# EAGLE design vending-machine-v2-raspberrypi-expansion-r1 (EAGLE 5.11)
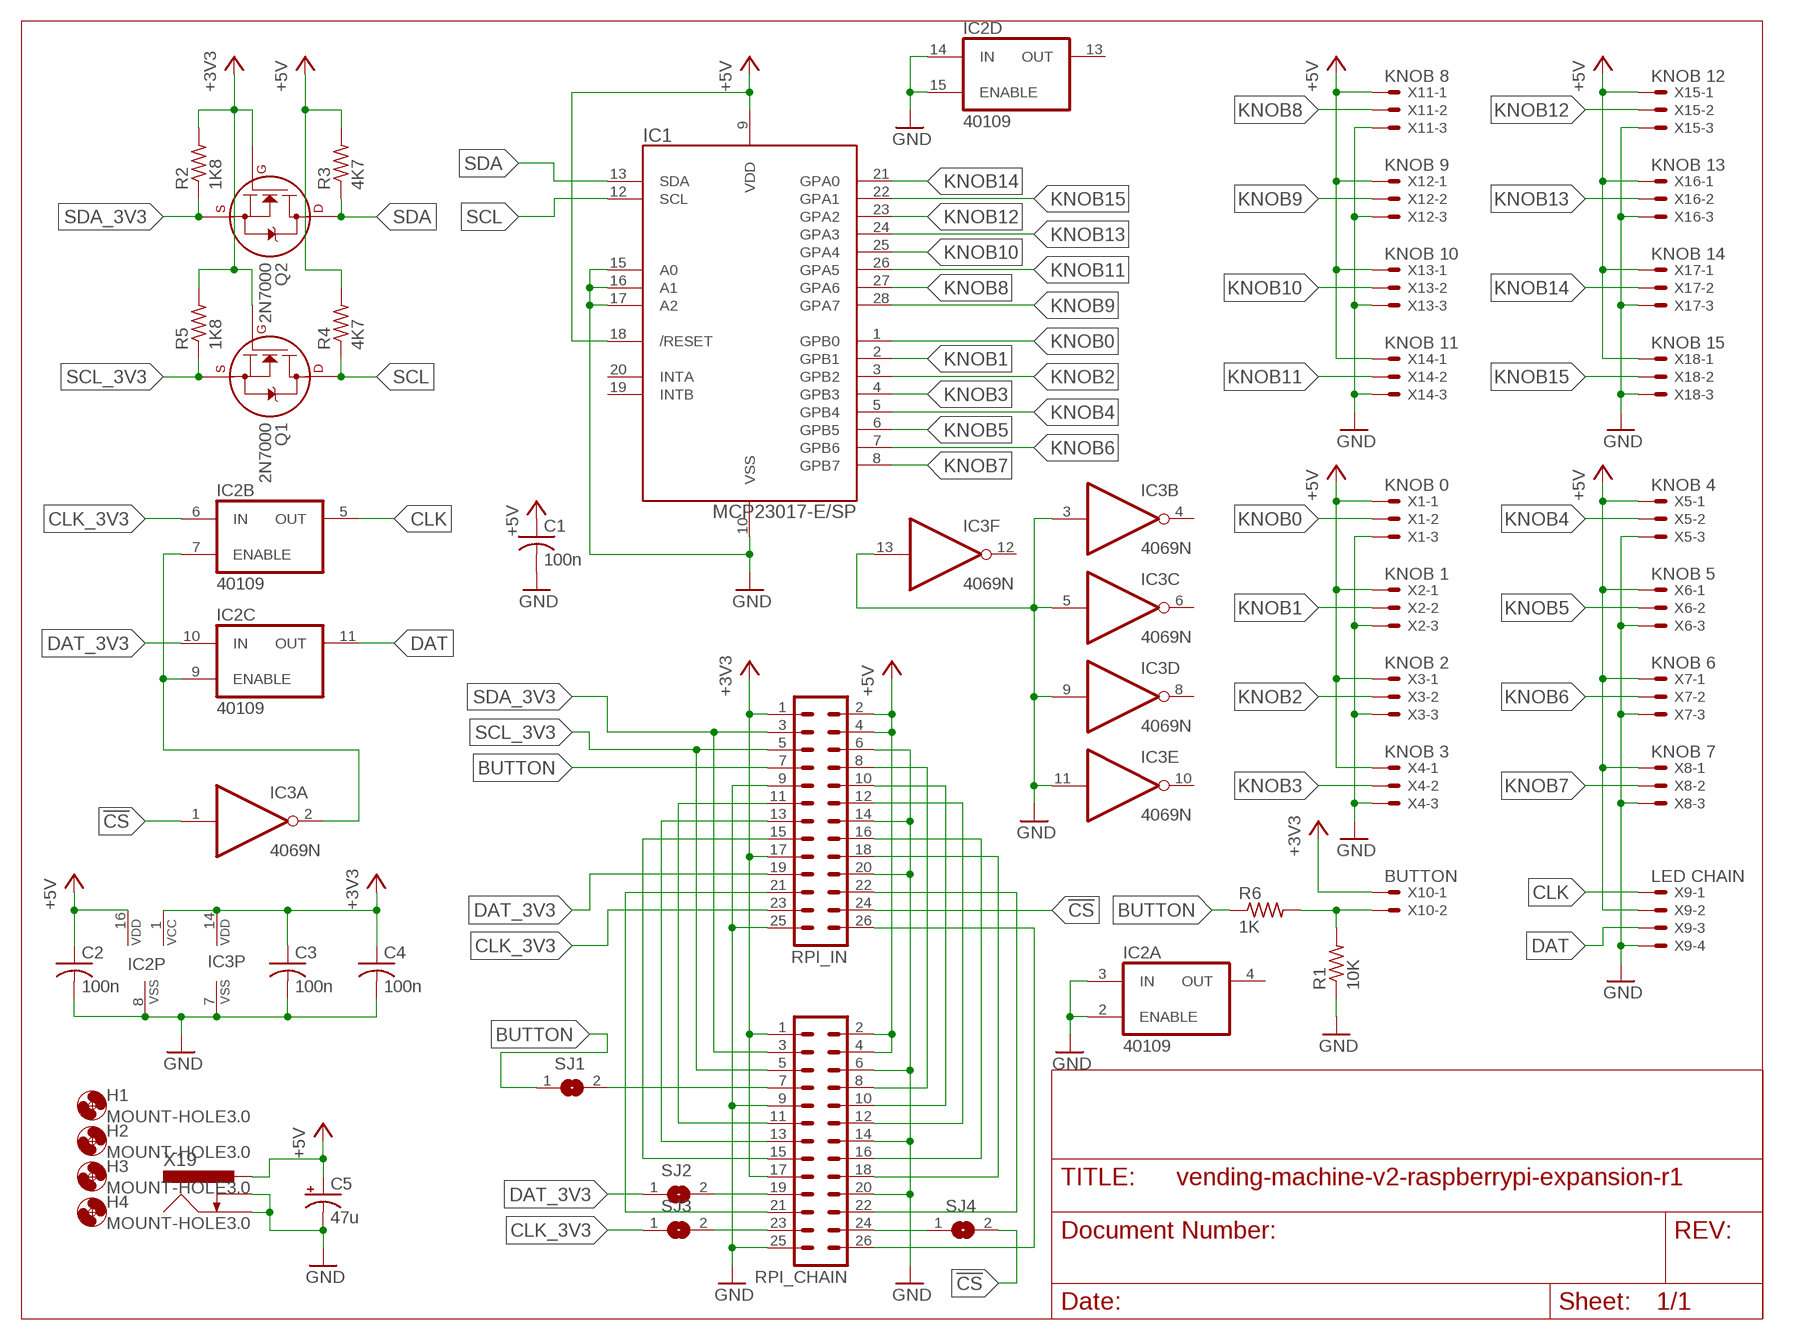
[diagram p0: schematic, sheet 1]

## Parts
C1  100n  C-US050-025X075  [C050-025X075]
C2  100n  C-US050-025X075  [C050-025X075]
C3  100n  C-US050-025X075  [C050-025X075]
C4  100n  C-US050-025X075  [C050-025X075]
C5  47u  CPOL-USE2.5-6  [E2,5-6]
H1  MOUNT-HOLE3.0  [3,0]
H2  MOUNT-HOLE3.0  [3,0]
H3  MOUNT-HOLE3.0  [3,0]
H4  MOUNT-HOLE3.0  [3,0]
IC1  MCP23017-E/SP  [DIP-28S]
IC2  40109  [DIL16]
IC3  4069N  [DIL14]
Q1  2N7000  2N7000_TO92  [TO-92]
Q2  2N7000  2N7000_TO92  [TO-92]
R1  10K  R-US_0207/10  [0207/10]
R2  1K8  R-US_0207/10  [0207/10]
R3  4K7  R-US_0207/10  [0207/10]
R4  4K7  R-US_0207/10  [0207/10]
R5  1K8  R-US_0207/10  [0207/10]
R6  1K  R-US_0207/10  [0207/10]
RPI_CHAIN  ML26  [ML26]
RPI_IN  ML26  [ML26]
SJ1  SJ  [SJ]
SJ2  SJ  [SJ]
SJ3  SJ  [SJ]
SJ4  SJ  [SJ]
X1  KNOB 0  22-23-2031  [22-23-2031]
X2  KNOB 1  22-23-2031  [22-23-2031]
X3  KNOB 2  22-23-2031  [22-23-2031]
X4  KNOB 3  22-23-2031  [22-23-2031]
X5  KNOB 4  22-23-2031  [22-23-2031]
X6  KNOB 5  22-23-2031  [22-23-2031]
X7  KNOB 6  22-23-2031  [22-23-2031]
X8  KNOB 7  22-23-2031  [22-23-2031]
X9  LED CHAIN  22-23-2041  [22-23-2041]
X10  BUTTON  22-23-2021  [22-23-2021]
X11  KNOB 8  22-23-2031  [22-23-2031]
X12  KNOB 9  22-23-2031  [22-23-2031]
X13  KNOB 10  22-23-2031  [22-23-2031]
X14  KNOB 11  22-23-2031  [22-23-2031]
X15  KNOB 12  22-23-2031  [22-23-2031]
X16  KNOB 13  22-23-2031  [22-23-2031]
X17  KNOB 14  22-23-2031  [22-23-2031]
X18  KNOB 15  22-23-2031  [22-23-2031]
X19  PJ-035D  PJ-002B  [PJ-002]

## Nets
!CS: IC3.1(A:I) RPI_IN.24 SJ4.2
+3V3: C3.1 C4.1 IC2.1(P:VCC) IC3.14(P:VDD) Q1.2(G) Q2.2(G) R2.2 R5.2 RPI_CHAIN.1 RPI_CHAIN.17 RPI_IN.1 RPI_IN.17 X10.1
+5V: C1.1 C2.1 C5.+ IC1.9(VDD) IC1.18(/RESET) IC2.16(P:VDD) R3.2 R4.2 RPI_CHAIN.2 RPI_CHAIN.4 RPI_IN.2 RPI_IN.4 X1.1 X2.1 X3.1 X4.1 X5.1 X6.1 X7.1 X8.1 X9.1 X11.1 X12.1 X13.1 X14.1 X15.1 X16.1 X17.1 X18.1 X19.1
BUTTON: R6.1 RPI_IN.7 SJ1.1
BUTTON_PRE: R1.2 R6.2 X10.2
CLK: IC2.5(B:OUT) X9.2
CLK_3V3: IC2.6(B:IN) RPI_IN.23 SJ3.1
DAT: IC2.11(C:OUT) X9.3
DAT_3V3: IC2.10(C:IN) RPI_IN.19 SJ2.1
GND: C1.2 C2.2 C3.2 C4.2 C5.- IC1.10(VSS) IC1.15(A0) IC1.16(A1) IC1.17(A2) IC2.2(A:ENABLE) IC2.3(A:IN) IC2.8(P:VSS) IC2.14(D:IN) IC2.15(D:ENABLE) IC3.3(B:I) IC3.5(C:I) IC3.7(P:VSS) IC3.9(D:I) IC3.11(E:I) IC3.13(F:I) R1.1 RPI_CHAIN.6 RPI_CHAIN.9 RPI_CHAIN.14 RPI_CHAIN.20 RPI_CHAIN.25 RPI_IN.6 RPI_IN.9 RPI_IN.14 RPI_IN.20 RPI_IN.25 X1.3 X2.3 X3.3 X4.3 X5.3 X6.3 X7.3 X8.3 X9.4 X11.3 X12.3 X13.3 X14.3 X15.3 X16.3 X17.3 X18.3 X19.2 X19.3
KNOB0: IC1.1(GPB0) X1.2
KNOB1: IC1.2(GPB1) X2.2
KNOB2: IC1.3(GPB2) X3.2
KNOB3: IC1.4(GPB3) X4.2
KNOB4: IC1.5(GPB4) X5.2
KNOB5: IC1.6(GPB5) X6.2
KNOB6: IC1.7(GPB6) X7.2
KNOB7: IC1.8(GPB7) X8.2
KNOB8: IC1.27(GPA6) X11.2
KNOB9: IC1.28(GPA7) X12.2
KNOB10: IC1.25(GPA4) X13.2
KNOB11: IC1.26(GPA5) X14.2
KNOB12: IC1.23(GPA2) X15.2
KNOB13: IC1.24(GPA3) X16.2
KNOB14: IC1.21(GPA0) X17.2
KNOB15: IC1.22(GPA1) X18.2
N$1: IC2.7(B:ENABLE) IC2.9(C:ENABLE) IC3.2(A:O)
N$2: RPI_CHAIN.11 RPI_IN.11
N$3: RPI_CHAIN.13 RPI_IN.13
N$4: RPI_CHAIN.15 RPI_IN.15
N$5: RPI_CHAIN.21 RPI_IN.21
N$6: RPI_CHAIN.8 RPI_IN.8
N$7: RPI_CHAIN.10 RPI_IN.10
N$8: RPI_CHAIN.12 RPI_IN.12
N$9: RPI_CHAIN.16 RPI_IN.16
N$10: RPI_CHAIN.18 RPI_IN.18
N$11: RPI_CHAIN.22 RPI_IN.22
N$12: RPI_CHAIN.26 RPI_IN.26
N$13: RPI_CHAIN.23 SJ3.2
N$14: RPI_CHAIN.19 SJ2.2
N$15: RPI_CHAIN.7 SJ1.2
N$16: RPI_CHAIN.24 SJ4.1
SCL: IC1.12(SCL) Q1.3(D) R4.1
SCL_3V3: Q1.1(S) R5.1 RPI_CHAIN.5 RPI_IN.5
SDA: IC1.13(SDA) Q2.3(D) R3.1
SDA_3V3: Q2.1(S) R2.1 RPI_CHAIN.3 RPI_IN.3
Unconnected: IC1.19(INTB) IC1.20(INTA) IC2.4(A:OUT) IC2.13(D:OUT) IC3.4(B:O) IC3.6(C:O) IC3.8(D:O) IC3.10(E:O) IC3.12(F:O)

## Library data of the parts
C1-C4 = rcl:C-US: CAPACITOR, American symbol
C5 = rcl:CPOL-US: POLARIZED CAPACITOR, American symbol
H1-H4 = holes:MOUNT-HOLE: MOUNTING HOLE with drill center marker
IC1 = rbg-microchip-ioexpander:MCP23017
IC2 = 40xx-2:40109
IC3 = 40xx:4069: Hex INVERTER
Q1 Q2 = transistors:2N700*: 2N7000, 2N7002, NDS7002A N-channel enhancement mode MOSFET
R1-R6 = rcl:R-US_: RESISTOR, American symbol
RPI_CHAIN RPI_IN = con-harting-ml:ML26: HARTING; OC_FARNELL: unknown; OC_NEWARK: unknown
SJ1-SJ4 = jumper:SJ: SMD solder JUMPER
X1-X8 X11-X18 = con-molex:22-23-2031: .100" (2.54mm) Center Header - 3 Pin; MF: MOLEX; MPN: 22-23-2031; OC_FARNELL: 1462950; OC_NEWARK: 30C0862
X9 = con-molex:22-23-2041: .100" (2.54mm) Center Header - 4 Pin; MF: MOLEX; MPN: 22-23-2041; OC_FARNELL: 1462920; OC_NEWARK: 38C0355
X10 = con-molex:22-23-2021: .100" (2.54mm) Center Header - 2 Pin; MF: MOLEX; MPN: 22-23-2021; OC_FARNELL: 1462926; OC_NEWARK: 25C3832
X19 = rbg-cui-dcpower:PJ-002

## Board
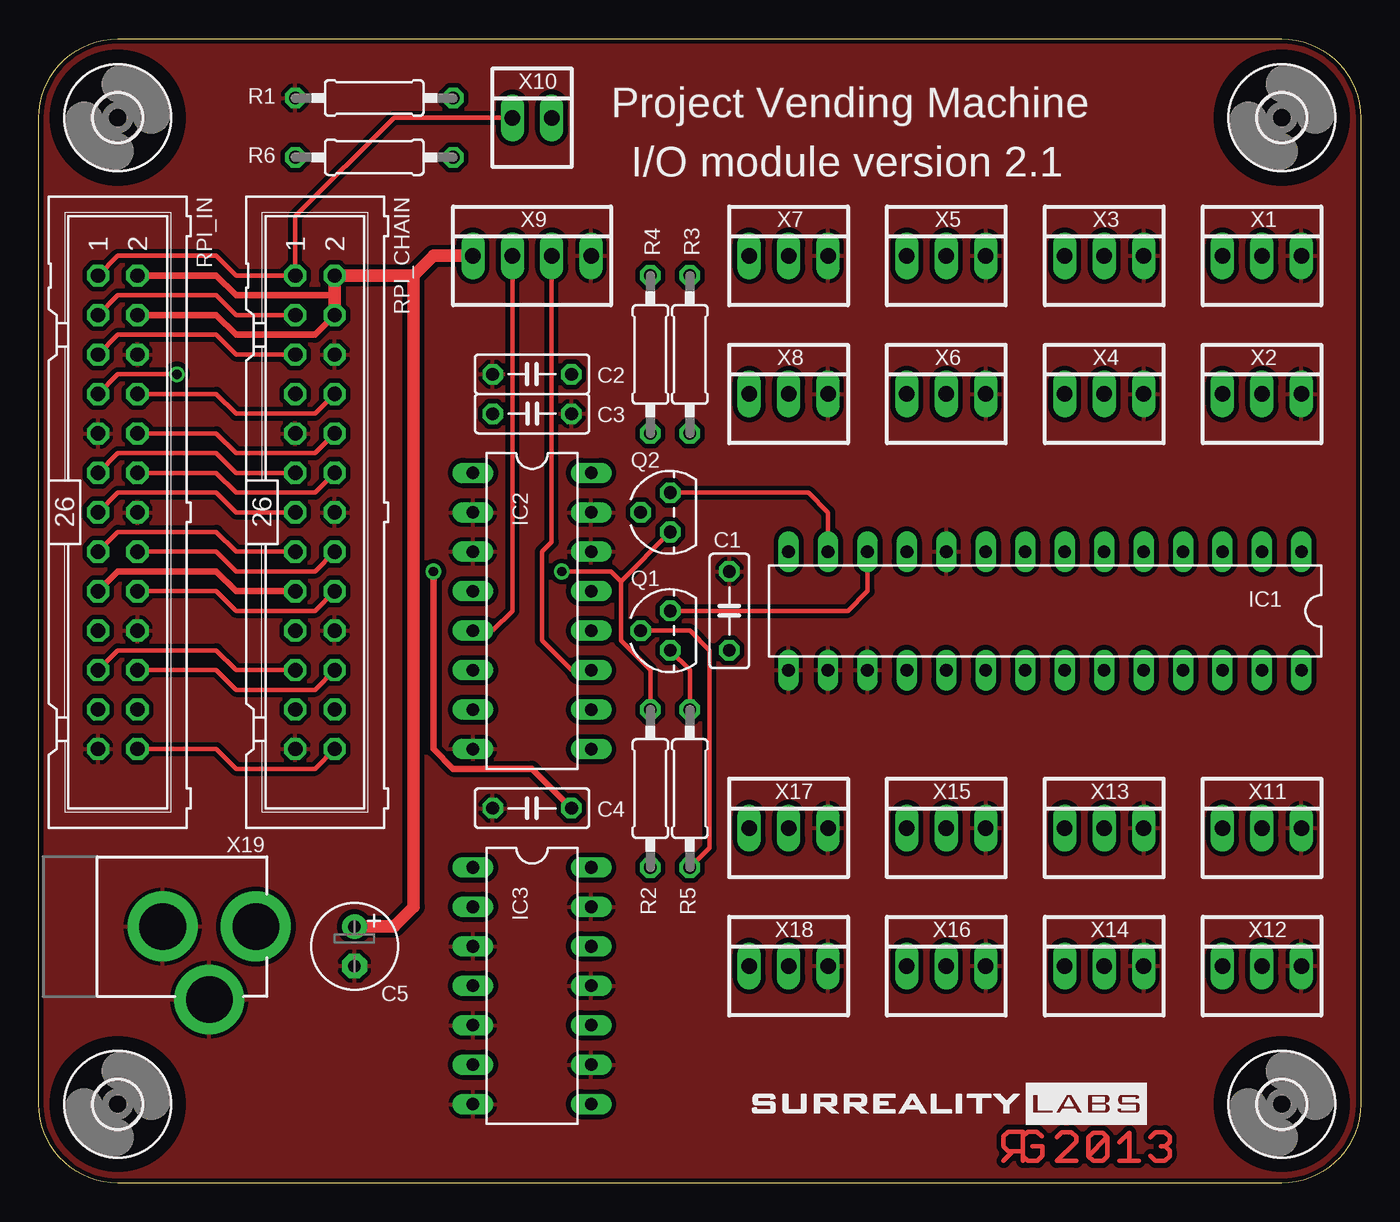
[diagram p1: board, top side]
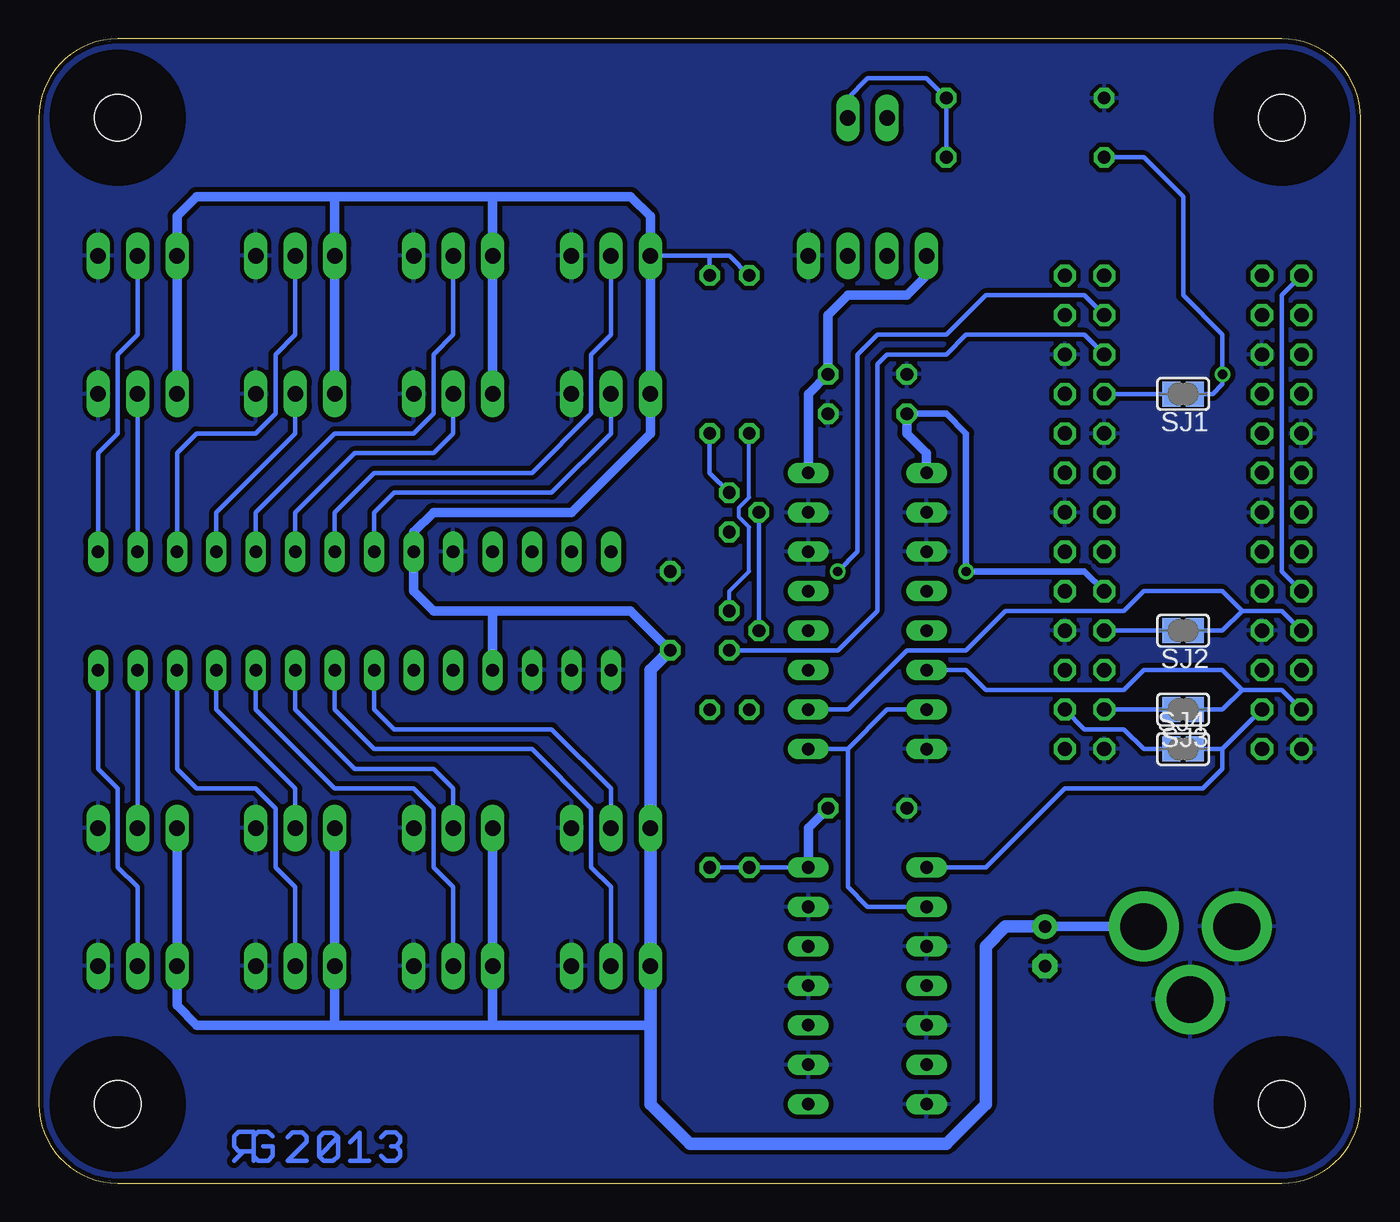
[diagram p2: board, bottom side, seen from below]

Size 85.09 x 73.66 mm. Coordinates in mm from the lower left corner, seen from the top.
Outline: 0,68.58 arc-90 5.08,73.66 80.01,73.66 arc-90 85.09,68.58 85.09,5.08 arc-90 80.01,0 5.08,0 arc-90 0,5.08 0,68.58
Copper layers (1*16): Top 0.035mm / dielectric 1.5mm / Bottom 0.035mm
Design rules "default *": minimum track width 10mil, minimum drill 20mil, track to track 8mil, track to pad 8mil, pad to pad 8mil, via to via 8mil, smd to smd 8mil, copper to edge 10mil, drill to drill 8mil, minimum pad ring 10mil, minimum via ring 8mil, stop-mask expansion 4mil, vias tented up to drill 0mil, thermal gap 10mil

### Footprints (pad centres in the part's own frame; a part is rotated, then mirrored left to right if it is on the bottom)
C050-025X075 = drill 0.813 octagon: 1 -2.54,0; 2 2.54,0
E2,5-6 = drill 0.813 pad 1.6 round: + -1.27,0 | drill 0.813 pad 1.6 octagon: - 1.27,0
3,0 = hole 3: 0,0
DIP-28S = drill 0.813 long: 1 -16.51,-3.81; 2 -13.97,-3.81; 3 -11.43,-3.81; 4 -8.89,-3.81; 5 -6.35,-3.81; 6 -3.81,-3.81; 7 -1.27,-3.81; 8 1.27,-3.81; 9 3.81,-3.81; 10 6.35,-3.81; 11 8.89,-3.81; 12 11.43,-3.81; 13 13.97,-3.81; 14 16.51,-3.81; 15 16.51,3.81; 16 13.97,3.81; 17 11.43,3.81; 18 8.89,3.81; 19 6.35,3.81; 20 3.81,3.81; 21 1.27,3.81; 22 -1.27,3.81; 23 -3.81,3.81; 24 -6.35,3.81; 25 -8.89,3.81; 26 -11.43,3.81; 27 -13.97,3.81; 28 -16.51,3.81
DIL16 = drill 0.813 long: 1 -8.89,-3.81; 2 -6.35,-3.81; 3 -3.81,-3.81; 4 -1.27,-3.81; 5 1.27,-3.81; 6 3.81,-3.81; 7 6.35,-3.81; 8 8.89,-3.81; 9 8.89,3.81; 10 6.35,3.81; 11 3.81,3.81; 12 1.27,3.81; 13 -1.27,3.81; 14 -3.81,3.81; 15 -6.35,3.81; 16 -8.89,3.81
DIL14 = drill 0.813 long: 1 -7.62,-3.81; 2 -5.08,-3.81; 3 -2.54,-3.81; 4 0,-3.81; 5 2.54,-3.81; 6 5.08,-3.81; 7 7.62,-3.81; 8 7.62,3.81; 9 5.08,3.81; 10 2.54,3.81; 11 0,3.81; 12 -2.54,3.81; 13 -5.08,3.81; 14 -7.62,3.81
TO-92 = drill 0.813 octagon: 1 -1.27,0; 2 0,1.905; 3 1.27,0
0207/10 = drill 0.813 octagon: 1 -5.08,0; 2 5.08,0
ML26 = drill 0.914 octagon: 1 -15.24,-1.27; 2 -15.24,1.27; 3 -12.7,-1.27; 4 -12.7,1.27; 5 -10.16,-1.27; 6 -10.16,1.27; 7 -7.62,-1.27; 8 -7.62,1.27; 9 -5.08,-1.27; 10 -5.08,1.27; 11 -2.54,-1.27; 12 -2.54,1.27; 13 0,-1.27; 14 0,1.27; 15 2.54,-1.27; 16 2.54,1.27; 17 5.08,-1.27; 18 5.08,1.27; 19 7.62,-1.27; 20 7.62,1.27; 21 10.16,-1.27; 22 10.16,1.27; 23 12.7,-1.27; 24 12.7,1.27; 25 15.24,-1.27; 26 15.24,1.27
SJ = smd 1.168 x 1.6: 1 -0.762,0; 2 0.762,0
22-23-2031 = drill 1 long: 1 -2.54,0; 2 0,0; 3 2.54,0
22-23-2041 = drill 1 long: 1 -3.81,0; 2 -1.27,0; 3 1.27,0; 4 3.81,0
22-23-2021 = drill 1 long: 1 -1.27,0; 2 1.27,0
PJ-002 = drill 3 pad 4.5 round: 1 0,0; 2 0,6; 3 -4.7,3

### Placement (x,y rotation side)
C1  44.45,36.83 90 top
C2  31.75,52.07 180 top
C3  31.75,49.53 0 top
C4  31.75,24.13 180 top
C5  20.32,15.24 270 top
H1  80.01,5.08 0 top
H2  80.01,68.58 0 top
H3  5.08,5.08 0 top
H4  5.08,68.58 0 top
IC1  64.77,36.83 180 top
IC2  31.75,36.83 270 top
IC3  31.75,12.7 270 top
Q1  40.64,35.56 90 top
Q2  40.64,43.18 90 top
R1  21.59,69.85 0 top
R2  39.37,25.4 270 top
R3  41.91,53.34 90 top
R4  39.37,53.34 90 top
R5  41.91,25.4 270 top
R6  21.59,66.04 0 top
RPI_CHAIN  17.78,43.18 270 top
RPI_IN  5.08,43.18 270 top
SJ1  11.43,50.8 180 bottom
SJ2  11.43,35.56 180 bottom
SJ3  11.43,30.48 180 bottom
SJ4  11.43,27.94 0 bottom
U$1  [RGLOGO_SMALL_2013]  63.5,1.27 0 top
U$2  [SURREALITY_LOGO_SILK]  45.72,3.81 0 top
U$3  [RGLOGO_SMALL_2013]  71.12,1.27 0 bottom
X1  78.74,59.69 0 top
X2  78.74,50.8 0 top
X3  68.58,59.69 0 top
X4  68.58,50.8 0 top
X5  58.42,59.69 0 top
X6  58.42,50.8 0 top
X7  48.26,59.69 0 top
X8  48.26,50.8 0 top
X9  31.75,59.69 0 top
X10  31.75,68.58 0 top
X11  78.74,22.86 0 top
X12  78.74,13.97 0 top
X13  68.58,22.86 0 top
X14  68.58,13.97 0 top
X15  58.42,22.86 0 top
X16  58.42,13.97 0 top
X17  48.26,22.86 0 top
X18  48.26,13.97 0 top
X19  13.97,16.51 90 top

### Tracks (layer width: path | path; a pad name or v marks a point on that pad's centre or on a via)
!CS
  Bottom 0.305: 8.89,27.94 SJ4.2 | 8.89,27.94 RPI_IN.24 | IC3.1 24.13,20.32 19.05,25.4 10.16,25.4 8.89,26.67 8.89,27.94
+3V3  (via drill 0.6)
  Top 0.305: RPI_IN.1 5.08,59.69 11.43,59.69 12.7,58.42 RPI_CHAIN.1 16.51,62.23 22.86,68.58 X10.1 | Q1.2 41.91,35.56 43.18,34.29 43.18,21.59 R5.2
  Top 0.406: RPI_CHAIN.17 12.7,38.1 11.43,39.37 5.08,39.37 RPI_IN.17 | v25.4,39.37 25.4,27.94 26.67,26.67 31.75,26.67 C4.1
  Bottom 0.305: RPI_IN.17 5.08,39.37 5.08,57.15 RPI_IN.1 | IC3.14 R2.2 R5.2 | Q1.2 Q2.2
  Bottom 0.406: RPI_CHAIN.17 17.78,39.37 v25.4,39.37 25.4,48.26 26.67,49.53 C3.1
  Bottom 0.61: IC2.1 27.94,46.99 29.21,48.26 C3.1 | IC3.14 35.56,22.86 C4.1
+5V
  Top 0.406: RPI_IN.4 11.43,55.88 12.7,54.61 17.78,54.61 RPI_CHAIN.4 | RPI_IN.2 11.43,58.42 12.7,57.15 19.05,57.15
  Top 0.813: RPI_CHAIN.4 19.05,57.15 RPI_CHAIN.2 24.13,58.42 | X9.1 25.4,59.69 24.13,58.42 | 24.13,58.42 24.13,17.78 22.86,16.51 C5.+
  Bottom 0.305: X7.1 41.91,59.69 | 41.91,59.69 40.64,59.69 R4.2 | 41.91,59.69 R3.2
  Bottom 0.61: X2.1 X1.1 76.2,62.23 74.93,63.5 66.04,63.5 | 55.88,63.5 46.99,63.5 45.72,62.23 X7.1 X8.1 45.72,48.26 50.8,43.18 59.69,43.18 60.96,41.91 IC1.9 60.96,38.1 59.69,36.83 55.88,36.83 | 55.88,63.5 66.04,63.5 | X6.1 X5.1 55.88,63.5 | X4.1 X3.1 66.04,63.5 | X11.1 X12.1 76.2,11.43 74.93,10.16 66.04,10.16 | 55.88,10.16 66.04,10.16 | 45.72,10.16 55.88,10.16 | X15.1 X16.1 55.88,10.16 | 66.04,10.16 X14.1 X13.1 | IC2.16 35.56,50.8 C2.1 34.29,55.88 33.02,57.15 29.21,57.15 27.94,58.42 X9.1 | X19.1 C5.+ | 55.88,36.83 IC1.18 | C1.1 46.99,36.83 55.88,36.83
  Bottom 0.813: C5.+ 22.86,16.51 24.13,15.24 24.13,5.08 26.67,2.54 43.18,2.54 45.72,5.08 45.72,10.16 X18.1 X17.1 45.72,33.02 C1.1
BUTTON  (via drill 0.6)
  Top 0.305: RPI_IN.7 5.08,52.07 v8.89,52.07
  Bottom 0.305: SJ1.1 9.53,50.8 8.89,51.44 v8.89,52.07 8.89,54.61 11.43,57.15 11.43,63.5 13.97,66.04 R6.1
BUTTON_PRE
  Bottom 0.305: X10.2 33.02,69.85 31.75,71.12 27.94,71.12 R1.2 R6.2
CLK
  Top 0.305: X9.2 30.48,36.83 29.21,35.56 IC2.5
CLK_3V3
  Bottom 0.305: SJ3.1 8.89,30.48 7.62,31.75 | 7.62,31.75 5.08,31.75 RPI_IN.23 | 7.62,31.75 8.89,33.02 13.97,33.02 15.24,31.75 24.13,31.75 25.4,33.02 IC2.6
DAT
  Top 0.305: X9.3 33.02,41.27 32.38,40.64 32.38,34.92 34.29,33.02 IC2.11
DAT_3V3
  Bottom 0.305: SJ2.1 8.89,35.56 7.62,36.83 | 7.62,36.83 5.08,36.83 RPI_IN.19 | 7.62,36.83 8.89,38.1 13.97,38.1 15.24,36.83 22.86,36.83 25.4,34.29 29.21,34.29 33.02,30.48 IC2.10
GND
  pour Bottom (isolate 0.305): -1.27,74.93 86.36,74.93 86.36,-1.27 -1.27,-1.27
  pour Top (isolate 0.305): -1.27,74.93 86.36,74.93 86.36,-1.27 -1.27,-1.27
KNOB0
  Bottom 0.305: IC1.1 81.28,46.99 80.01,48.26 80.01,53.34 78.74,54.61 X1.2
KNOB1
  Bottom 0.305: IC1.2 X2.2
KNOB2
  Bottom 0.305: IC1.3 76.2,46.99 74.93,48.26 71.12,48.26 69.85,49.53 69.85,53.34 68.58,54.61 X3.2
KNOB3
  Bottom 0.305: IC1.4 73.66,43.18 68.58,48.26 X4.2
KNOB4
  Bottom 0.305: IC1.5 71.12,43.18 66.04,48.26 60.96,48.26 59.69,49.53 59.69,53.34 58.42,54.61 X5.2
KNOB5
  Bottom 0.305: IC1.6 68.58,43.18 64.77,46.99 59.69,46.99 58.42,48.26 X6.2
KNOB6
  Bottom 0.305: IC1.7 66.04,43.18 63.5,45.72 53.34,45.72 49.53,49.53 49.53,53.34 48.26,54.61 X7.2
KNOB7
  Bottom 0.305: IC1.8 63.5,43.18 62.23,44.45 52.07,44.45 48.26,48.26 X8.2
KNOB8
  Bottom 0.305: X11.2 IC1.27
KNOB9
  Bottom 0.305: IC1.28 81.28,26.67 80.01,25.4 80.01,20.32 78.74,19.05 X12.2
KNOB10
  Bottom 0.305: IC1.25 73.66,30.48 68.58,25.4 X13.2
KNOB11
  Bottom 0.305: IC1.26 76.2,26.67 74.93,25.4 71.12,25.4 69.85,24.13 69.85,20.32 68.58,19.05 X14.2
KNOB12
  Bottom 0.305: IC1.23 68.58,30.48 64.77,26.67 59.69,26.67 58.42,25.4 X15.2
KNOB13
  Bottom 0.305: IC1.24 71.12,30.48 66.04,25.4 60.96,25.4 59.69,24.13 59.69,20.32 58.42,19.05 X16.2
KNOB14
  Bottom 0.305: IC1.21 63.5,30.48 62.23,29.21 52.07,29.21 48.26,25.4 X17.2
KNOB15
  Bottom 0.305: IC1.22 66.04,30.48 63.5,27.94 53.34,27.94 49.53,24.13 49.53,20.32 48.26,19.05 X18.2
N$1
  Bottom 0.305: IC2.7 30.48,30.48 33.02,27.94 | 33.02,27.94 IC2.9 | IC3.2 31.75,17.78 33.02,19.05 33.02,27.94
N$2
  Top 0.305: RPI_CHAIN.11 12.7,45.72 11.43,46.99 5.08,46.99 RPI_IN.11
N$3
  Top 0.305: RPI_CHAIN.13 12.7,43.18 11.43,44.45 5.08,44.45 RPI_IN.13
N$4
  Top 0.305: RPI_IN.15 5.08,41.91 11.43,41.91 12.7,40.64 RPI_CHAIN.15
N$5
  Top 0.305: RPI_IN.21 5.08,34.29 11.43,34.29 12.7,33.02 RPI_CHAIN.21
N$6
  Top 0.305: RPI_IN.8 11.43,50.8 12.7,49.53 17.78,49.53 RPI_CHAIN.8
N$7
  Top 0.305: RPI_IN.10 11.43,48.26 12.7,46.99 17.78,46.99 RPI_CHAIN.10
N$8
  Top 0.305: RPI_IN.12 11.43,45.72 12.7,44.45 17.78,44.45 RPI_CHAIN.12
N$9
  Top 0.305: RPI_IN.16 11.43,40.64 12.7,39.37 17.78,39.37 RPI_CHAIN.16
N$10
  Top 0.305: RPI_IN.18 11.43,38.1 12.7,36.83 17.78,36.83 RPI_CHAIN.18
N$11
  Top 0.305: RPI_IN.22 11.43,33.02 12.7,31.75 17.78,31.75 RPI_CHAIN.22
N$12
  Top 0.305: RPI_IN.26 11.43,27.94 12.7,26.67 17.78,26.67 RPI_CHAIN.26
N$13
  Bottom 0.305: SJ3.2 RPI_CHAIN.23
N$14
  Bottom 0.305: SJ2.2 RPI_CHAIN.19
N$15
  Bottom 0.305: SJ1.2 RPI_CHAIN.7
N$16
  Bottom 0.305: RPI_CHAIN.24 17.78,29.21 15.24,29.21 13.97,27.94 SJ4.1
SCL
  Top 0.305: IC1.12 53.34,38.1 52.07,36.83 Q1.3
  Bottom 0.254: Q1.3 40.64,38.1 39.37,39.37 39.37,42.23 40.01,42.86 40.01,43.5 39.37,44.13 R4.1
SCL_3V3
  Top 0.305: RPI_IN.5 5.08,54.61 11.43,54.61 12.7,53.34 RPI_CHAIN.5 | R5.1 41.91,33.02 Q1.1
  Bottom 0.305: RPI_CHAIN.5 17.78,54.61 25.4,54.61 26.67,53.34 30.48,53.34 31.11,52.7 31.11,36.83 33.66,34.29 Q1.1
SDA
  Top 0.305: IC1.13 50.8,43.18 49.53,44.45 Q2.3
  Bottom 0.305: R3.1 41.91,45.72 Q2.3
SDA_3V3  (via drill 0.6)
  Top 0.305: RPI_CHAIN.3 12.7,55.88 11.43,57.15 5.08,57.15 RPI_IN.3 | R2.1 39.37,33.02 37.47,34.92 37.47,38.73 | 37.47,38.73 Q2.1 | v33.66,39.37 36.83,39.37 37.47,38.73
  Bottom 0.305: RPI_CHAIN.3 17.78,57.15 24.13,57.15 26.67,54.61 31.11,54.61 32.38,53.34 32.38,40.64 v33.66,39.37

### Text on the board
tNames: Project Vending Machine | I/O module version 2.1